# Altium schematic sheet rasp_sheild_CAN.SchDoc
size Tabloid; SheetNumber: 5; SheetTotal: 5; Sheet_Name: Comminication CAN; Size: 11x17
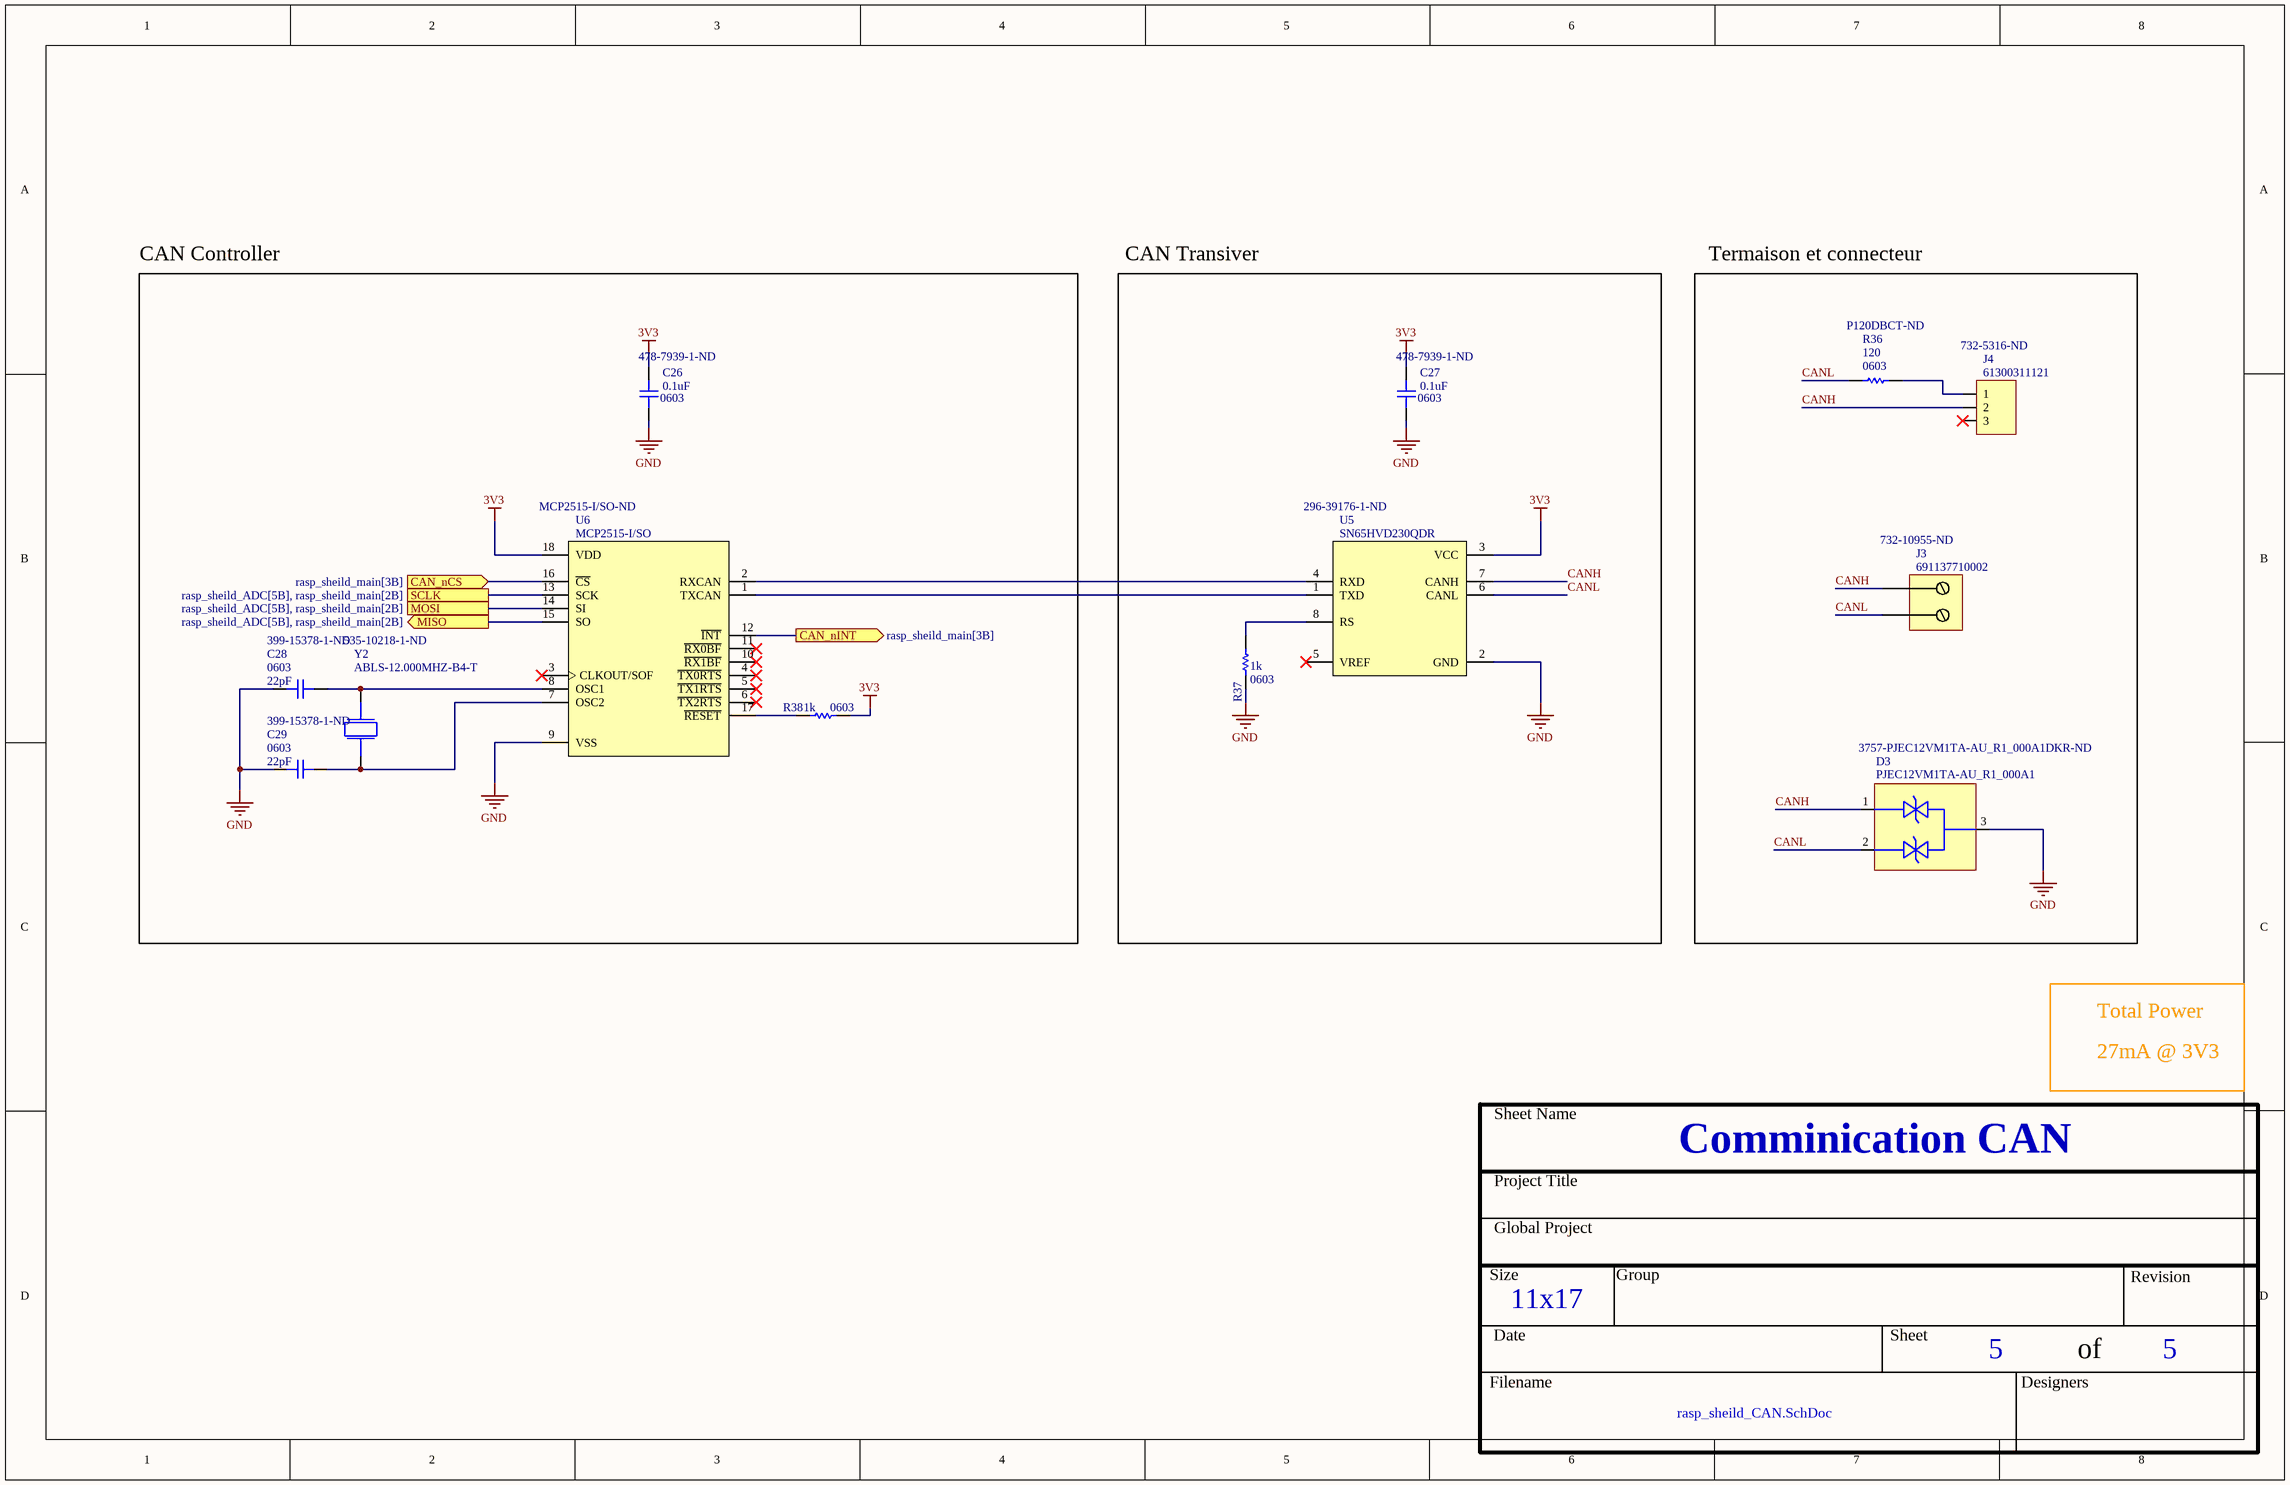
[diagram p0: rasp_sheild_CAN.SchDoc]

## Parts
C26  value 0.1uF  Package: 0603  Supplier Part Number 1: 478-7939-1-ND  [CAP_0603]  (hidden comment: Part Number)
C27  value 0.1uF  Package: 0603  Supplier Part Number 1: 478-7939-1-ND  [CAP_0603]  (hidden comment: Part Number)
C28  value 22pF  Package: 0603  Supplier Part Number 1: 399-15378-1-ND  [CAP_0603]  (hidden comment: Part Number)
C29  value 22pF  Package: 0603  Supplier Part Number 1: 399-15378-1-ND  [CAP_0603]  (hidden comment: Part Number)
D3  PJEC12VM1TA-AU_R1_000A1  Supplier Part Number 1: 3757-PJEC12VM1TA-AU_R1_000A1DKR-ND  [SOT-23-3]
J3  691137710002  Supplier Part Number 1: 732-10955-ND  [691137710002]
J4  61300311121  Supplier Part Number 1: 732-5316-ND  [61300311121]
R36  value 120  Package: 0603  Supplier Part Number 1: P120DBCT-ND  [RES_0603]  (hidden comment: Part Number)
R37  value 1k  Package: 0603  [RES_0603]  (hidden comment: Part Number)
R38  value 1k  Package: 0603  [RES_0603]  (hidden comment: Part Number)
U5  SN65HVD230QDR  Supplier Part Number 1: 296-39176-1-ND  [8-SOIC]
U6  MCP2515-I/SO  Supplier Part Number 1: MCP2515-I/SO-ND  [18-SOIC]
Y2  ABLS-12.000MHZ-B4-T  Supplier Part Number 1: 535-10218-1-ND  [ABLS-12.000MHZ-B4-T]

## Blocks framed on the sheet
CAN Controller: C26 C28 C29 R38 U6 Y2
CAN Transiver: C27 R37 U5
Termaison et connecteur: D3 J3 J4 R36

## Ports
CAN_nCS (in, see rasp_sheild_main[3B]), CAN_nINT (out, see rasp_sheild_main[3B]), MISO (out, see rasp_sheild_ADC[5B], rasp_sheild_main[2B]), MOSI (see rasp_sheild_ADC[5B], rasp_sheild_main[2B]), SCLK (see rasp_sheild_ADC[5B], rasp_sheild_main[2B])

## Nets
3V3: C26.2 C27.2 R38.1 U5.3(VCC) U6.18(VDD)
GND: C26.1 C27.1 C28.2 C29.2 D3.3 R37.2 U5.2(GND) U6.9(VSS)
CAN_nCS: U6.16(~{CS}) ; port CAN_nCS
CAN_nINT: U6.12(~{INT}) ; port CAN_nINT
CANH: D3.1 J3.1 J4.2 U5.7(CANH)
CANL: D3.2 J3.2 R36.2 U5.6(CANL)
MISO: U6.15(SO) ; port MISO
MOSI: U6.14(SI) ; port MOSI
SCLK: U6.13(SCK) ; port SCLK
NetC28_1: C28.1 U6.8(OSC1) Y2.2
NetC29_1: C29.1 U6.7(OSC2) Y2.1
NetJ4_1: J4.1 R36.1
NetR37_1: R37.1 U5.8(RS)
NetR38_2: R38.2 U6.17(~{RESET})
NetU5_1: U5.1(TXD) U6.1(TXCAN)
NetU5_4: U5.4(RXD) U6.2(RXCAN)

Not connected (* = marked no-connect by the designer): J4 3*; U5 5(VREF)*; U6 3(CLKOUT/SOF)* 4(~{TX0RTS})* 5(~{TX1RTS})* 6(~{TX2RTS})* 10(~{RX1BF})* 11(~{RX0BF})*

## Notes on the sheet
- Total Power
- 27mA @ 3V3
- Sheet Name
- Project Title
- Global Project
- Size
- Group
- Revision
- Date
- Sheet
- of
- Filename
- Designers

## Library data of the parts
C26-C29 = CAP_0603: XXX - Description - Package; GRAMS Lib Spec: 2.7; Supplier 1: Digi-Key
D3 = PJEC12VM1TA-AU_R1_000A1: XXX - Description - Package; GRAMS Lib Spec: 2.7; Supplier 1: Digi-Key
J3 = 691137710002: 2 Position Wire to Board Terminal Block Horizontal with Board 0.197" (5.00mm) Through Hole; GRAMS Lib Spec: 2.7; Supplier 1: Digi-Key
J4 = 61300311121: Connector Header Through Hole 3 position 0.100" (2.54mm)pr; GRAMS Lib Spec: 2.7; Supplier 1: Digi-Key
R36-R38 = RES_0603: XXX - Description - Package; GRAMS Lib Spec: 2.7; Supplier 1: Digi-Key
  R37 R38: Supplier Part Number 1: 311-1.00KHRCT-ND
U5 = SN65HVD230QDR: 1/1 Transceiver Half CANbus 8-SOIC; GRAMS Lib Spec: 2.7; Supplier 1: Digi-Key
U6 = MCP2515-I/SO: CANbus Controller CAN 2.0 SPI Interface 18-SOIC; GRAMS Lib Spec: 2.7; Supplier 1: Digi-Key
Y2 = ABLS-12.000MHZ-B4-T: 12 MHz ±30ppm Crystal 18pF 50 Ohms HC-49/US; GRAMS Lib Spec: 2.7; Supplier 1: Digi-Key